# Altium project wing2.PrjPcb
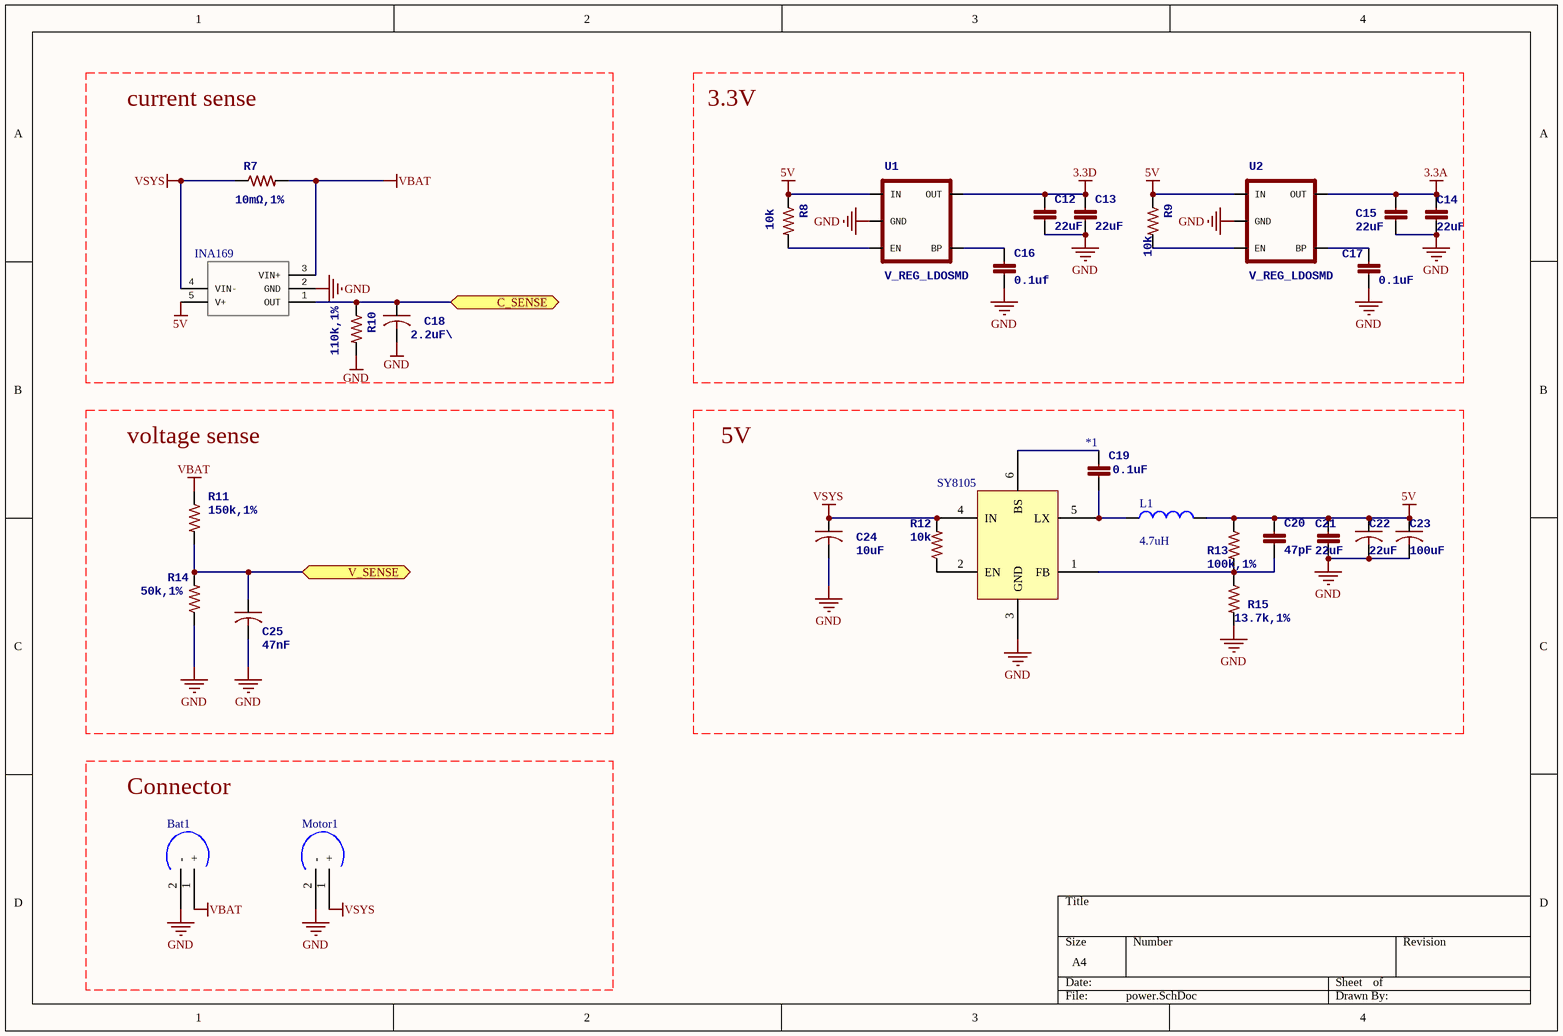
[diagram p0: power.SchDoc]
3 sheets, 79 parts. Net scope: flat (ports and power ports of the same name join across sheets).
Board file: wing2.PcbDoc
Sheets:
  power.SchDoc
  mcu.SchDoc
  sensor.SchDoc

## Sheet power.SchDoc
size A4

### Parts
*1  SY8105  [SOT23-6]
Bat1  Battery_AWG12  [Battery_AWG12]  (value not drawn)
C12  22uF  [0805]
C13  22uF  [0805]
C14  22uF  [0805]
C15  22uF  [0805]
C16  0.1uf  [0402]
C17  0.1uF  [0402]
C18  2.2uF\  [0402]
C19  0.1uF  [0603]
C20  47pF  [0402]
C21  22uF  [0805]
C22  22uF  [0805]
C23  100uF  [1210]
C24  10uF  [0805]
C25  47nF  [0402]
L1  value 4.7uH  [L6028/L6045]  (hidden comment: Inductor)
Motor1  Battery_AWG12  [Battery_AWG12]  (value not drawn)
R7  10mΩ,1%  [2512]
R8  10k  [0402]
R9  10k  [0402]
R10  110k,1%  [0402]
R11  150k,1%  [0402]
R12  10k  [0402]
R13  100k,1%  [0402]
R14  50k,1%  [0402]
R15  13.7k,1%  [0402]
U1  V_REG_LDOSMD  [SOT23-5]
U2  V_REG_LDOSMD  [SOT23-5]
U$1  INA169  [SOT23-5]

### Ports
C_SENSE, V_SENSE

### Nets
3.3A: C14.1 C15.1 U2.5(OUT)
3.3D: C12.1 C13.1 U1.5(OUT)
5V: C20.1 C21.1 C22.1 C23.1 L1.2 R8.1 R9.1 R13.1 U1.1(IN) U2.1(IN) U$1.5(V+)
GND: *1.3(GND) Bat1.2(-) C12.2 C13.2 C14.2 C15.2 C16.2 C17.2 C18.2 C21.2 C22.2 C23.2 C24.2 C25.2 Motor1.2(-) R10.2 R14.1 R15.2 U1.2(GND) U2.2(GND) U$1.2(GND)
VBAT: Bat1.1(+) R7.P$2 R11.1 U$1.3(VIN+)
VSYS: *1.4(IN) C24.1 Motor1.1(+) R7.P$1 R12.2 U$1.4(VIN-)
Net*1_1: *1.1(FB) C20.2 R13.2 R15.1
Net*1_2: *1.2(EN) R12.1
Net*1_5: *1.5(LX) C19.2 L1.1
Net*1_6: *1.6(BS) C19.1
NetADC1_4: C25.1 R11.2 R14.2 ; port V_SENSE
NetADC1_5: C18.1 R10.1 U$1.1(OUT) ; port C_SENSE
NetC16_1: C16.1 U1.4(BP)
NetC17_1: C17.1 U2.4(BP)
NetR8_2: R8.2 U1.3(EN)
NetR9_2: R9.2 U2.3(EN)

### Notes on the sheet
- current sense
- 3.3V
- voltage sense
- 5V
- Connector

### Library data of the parts
C12-C17 C19-C21 = CAP0402-CAP: <b>Capacitor</b> / Standard 0603 ceramic capacitor, and 0.1" leaded capacitor.; PARTNO: CC0402ZRY5V7BB104
C18 C22-C25 = C-USC0402: <B>CAPACITOR</B>, American symbol
L1 = Inductor: Code_IEC: 1005; Published: 8-Jun-2000; LatestRevisionDate: 29-May-2009; LatestRevisionNote: IPC-7351 Footprint Added.; PackageReference: 0402-A; Publisher: Altium Limited; PackageDescription: Chip Inductor; Code_JEITA: 0402
R7 = CSS2725FTL250: pin to pad: P$1>2 P$2>1; DIGIKEY: http://search.digikey.com/us/en/products/CSS2725FTL250/CSS2725FTL250CT-ND/1923235; MFGPN: CSS2725FTL250
R8-R15 = RESISTOR0402-RES: <b>Resistor</b> / Basic schematic elements and footprints for 0603, 1206, and PTH resistors.
U1 U2 = V_REG_LDOSMD: <b>Voltage Regulator LDO</b> / Standard 150mA LDO voltage regulator in SOT-23 layout. Micrel part MIC5205. BP (by-pass) pin is used to lower output noise with 470pF cap.; PARTNO: MIC5207-3.3YM5

## Sheet mcu.SchDoc
size A4
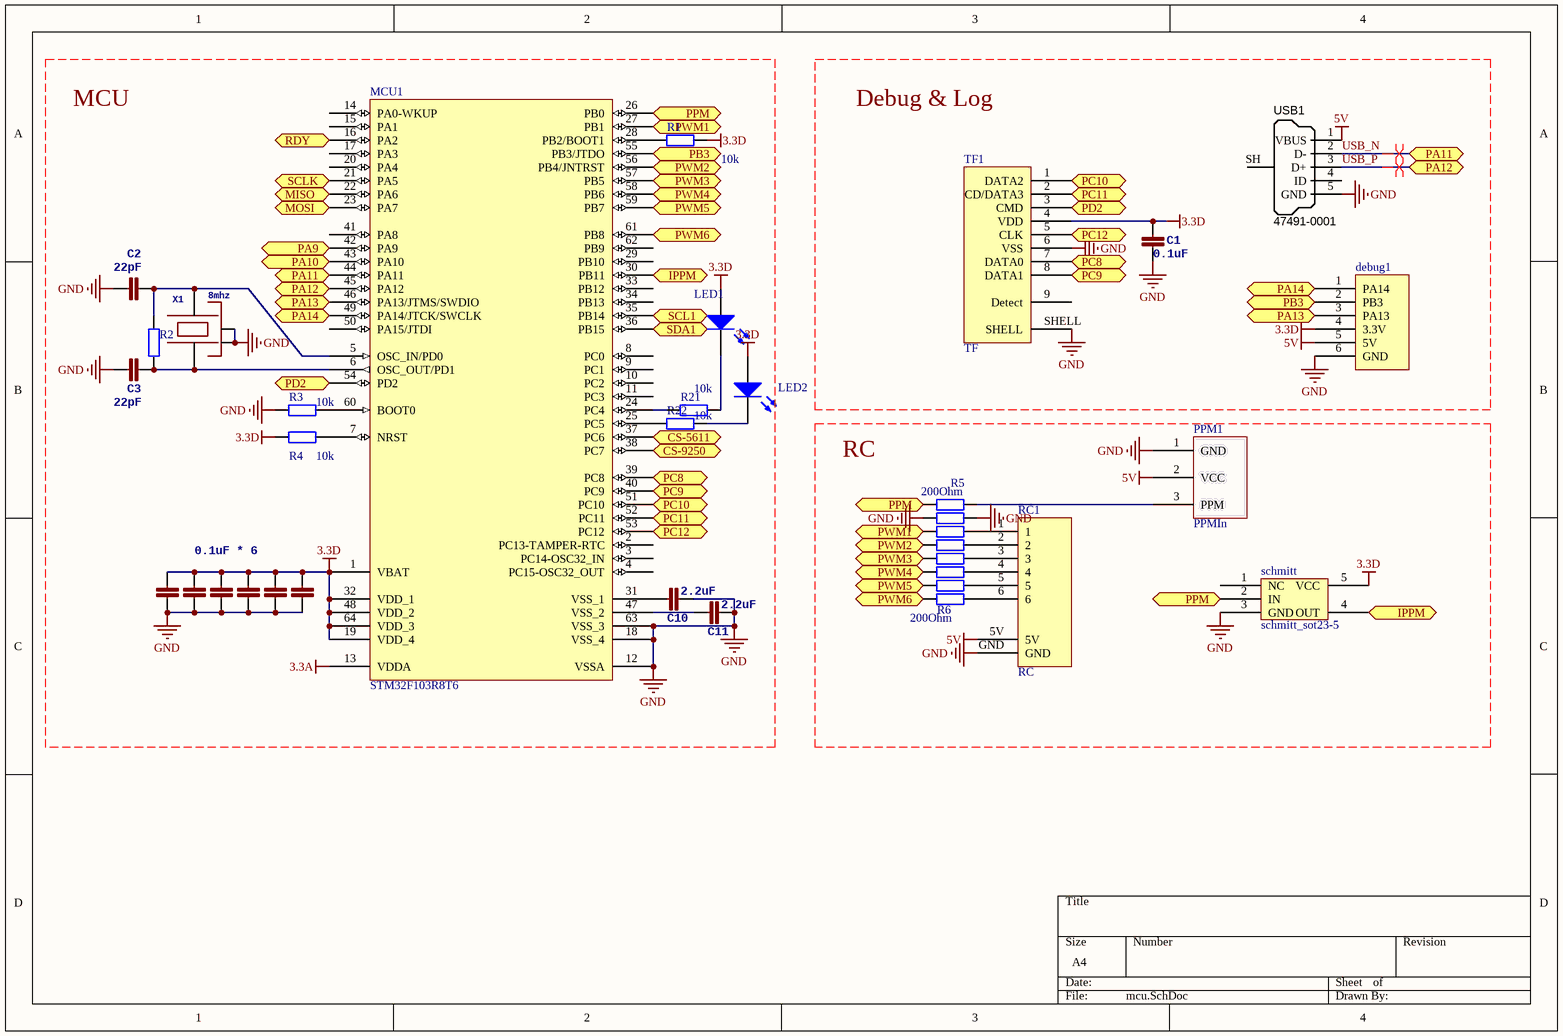
[diagram p1: mcu.SchDoc]

### Parts
C1  0.1uF  [0402]
C2  22pF  [0402]
C3  22pF  [0402]
C4  0.1uF * 6  [0402]
C5  1n  [0402]  (value not drawn)
C6  1n  [0402]  (value not drawn)
C7  1n  [0402]  (value not drawn)
C8  1n  [0402]  (value not drawn)
C9  1n  [0402]  (value not drawn)
C10  2.2uF  [0603]
C11  2.2uF  [0603]
debug1  debug  [WFRSM125]  (value not drawn)
LED1  LED0  [0603]  (value not drawn)
LED2  LED0  [0603]  (value not drawn)
MCU1  STM32F103R8T6  [LQFP64_N]
PPM1  PPMIn  [ServoConnector]
R1  10k  [0402]
R2  (no value)  [0402]
R3  10k  [0402]
R4  10k  [0402]
R5  value 200Ohm  [0402X4]  (hidden comment: Res*4)
R6  value 200Ohm  [0402X4]  (hidden comment: Res*4)
R21  10k  [0402]
R22  10k  [0402]
RC1  RC  [6P]
schmitt  schmitt_sot23-5  [SOT23-5]
TF1  TF  [TF]
USB1  Manufacturer Part Number 1: 47491-0001  [MOLEX-47346-0001]  (hidden comment: USB Micro Type B)
X1  8mhz  [OSCILLATOR-3.2X2.5]

### Ports
CS-5611, CS-9250, IPPM, MISO, MOSI, PA9, PA10, PA11, PA12, PA13, PA14, PB3, PC8, PC9, PC10, PC11, PC12, PD2, PPM, PWM1, PWM2, PWM3, PWM4, PWM5, PWM6, RDY, SCL1, SCLK, SDA1

### Nets
3.3A: MCU1.13(VDDA)
3.3D: C1.2 C4.2 C5.2 C6.2 C7.2 C8.2 C9.2 debug1.4(3.3V) LED1.1(A) LED2.1(A) MCU1.1(VBAT) MCU1.19(VDD_4) MCU1.32(VDD_1) MCU1.48(VDD_2) MCU1.64(VDD_3) R1.2 R4.2 schmitt.5(VCC) TF1.4(VDD)
5V: debug1.5(5V) PPM1.2(VCC) RC1.5V USB1.1(VBUS)
GND: C1.1 C2.2 C3.2 C4.1 C5.1 C6.1 C7.1 C8.1 C9.1 C10.2 C11.2 debug1.6(GND) MCU1.12(VSSA) MCU1.18(VSS_4) MCU1.63(VSS_3) PPM1.1(GND) R3.1 R5.2 R5.7 RC1.GND schmitt.3(GND) TF1.6(VSS) TF1.SHELL USB1.5(GND) X1.2(NC_2) X1.4(NC_4)
USB_N: MCU1.44(PA11) USB1.2(D-) ; port PA11
USB_P: MCU1.45(PA12) USB1.3(D+) ; port PA12
NetADC1_9: MCU1.36(PB15) ; port SDA1
NetADC1_10: MCU1.35(PB14) ; port SCL1
NetBaro1_5: MCU1.37(PC6) ; port CS-5611
NetBaro1_6: MCU1.22(PA6) ; port MISO
NetBaro1_7: MCU1.23(PA7) ; port MOSI
NetBaro1_8: MCU1.21(PA5) ; port SCLK
NetC2_1: C2.1 MCU1.5(OSC_IN/PD0) R2.2 X1.3
NetC3_1: C3.1 MCU1.6(OSC_OUT/PD1) R2.1 X1.1
NetC10_1: C10.1 MCU1.31(VSS_1)
NetC11_1: C11.1 MCU1.47(VSS_2)
Netdebug1_1: debug1.1(PA14) MCU1.49(PA14/JTCK/SWCLK) ; port PA14
Netdebug1_2: debug1.2(PB3) MCU1.55(PB3/JTDO) ; port PB3
Netdebug1_3: debug1.3(PA13) MCU1.46(PA13/JTMS/SWDIO) ; port PA13
NetGPS1_3: MCU1.43(PA10) ; port PA10
NetGPS1_4: MCU1.42(PA9) ; port PA9
NetLED1_2: LED1.2(K) R21.2
NetLED2_2: LED2.2(K) R22.2
NetMCU1_7: MCU1.7(NRST) R4.1
NetMCU1_16: MCU1.16(PA2) ; port RDY
NetMCU1_24: MCU1.24(PC4) R21.1
NetMCU1_25: MCU1.25(PC5) R22.1
NetMCU1_26: MCU1.26(PB0) R5.1 schmitt.2(IN) ; port PPM
NetMCU1_27: MCU1.27(PB1) R5.3 ; port PWM1
NetMCU1_28: MCU1.28(PB2/BOOT1) R1.1
NetMCU1_30: MCU1.30(PB11) schmitt.4(OUT) ; port IPPM
NetMCU1_38: MCU1.38(PC7) ; port CS-9250
NetMCU1_39: MCU1.39(PC8) TF1.7(DATA0) ; port PC8
NetMCU1_40: MCU1.40(PC9) TF1.8(DATA1) ; port PC9
NetMCU1_51: MCU1.51(PC10) TF1.1(DATA2) ; port PC10
NetMCU1_52: MCU1.52(PC11) TF1.2(CD/DATA3) ; port PC11
NetMCU1_53: MCU1.53(PC12) TF1.5(CLK) ; port PC12
NetMCU1_54: MCU1.54(PD2) TF1.3(CMD) ; port PD2
NetMCU1_56: MCU1.56(PB4/JNTRST) R5.4 ; port PWM2
NetMCU1_57: MCU1.57(PB5) R6.1 ; port PWM3
NetMCU1_58: MCU1.58(PB6) R6.2 ; port PWM4
NetMCU1_59: MCU1.59(PB7) R6.3 ; port PWM5
NetMCU1_60: MCU1.60(BOOT0) R3.2
NetMCU1_61: MCU1.61(PB8) R6.4 ; port PWM6
NetPPM1_3: PPM1.3(PPM) R5.8
NetR5_5: R5.5 RC1.2
NetR5_6: R5.6 RC1.1
NetR6_5: R6.5 RC1.6
NetR6_6: R6.6 RC1.5
NetR6_7: R6.7 RC1.4
NetR6_8: R6.8 RC1.3

Not connected (* = marked no-connect by the designer): MCU1 2(PC13-TAMPER-RTC) 3(PC14-OSC32_IN) 4(PC15-OSC32_OUT) 8(PC0) 9(PC1) 10(PC2) 11(PC3) 14(PA0-WKUP) 15(PA1) 17(PA3) 20(PA4) 29(PB10) 33(PB12) 34(PB13) 41(PA8) 50(PA15/JTDI) 62(PB9); schmitt 1(NC); TF1 9(Detect); USB1 4(ID) SH(Shell)

### Layout directives
differential pair: USB_N, USB_P

### Notes on the sheet
- MCU
- Debug & Log
- RC

### Library data of the parts
C1-C11 = CAP0402-CAP: as C12 on sheet power
LED1 LED2 = LED0: Typical INFRARED GaAs LED; Published: 8-Jun-2000; LatestRevisionDate: 08-Jul-2005; LatestRevisionNote: Mech Layer 1 removed.; PackageReference: LED-0; Publisher: Altium Limited; PackageDescription: LED; 2 Leads
MCU1 = STM32F103R8T6: STM32 ARM-based 32-bit MCU with 64 Kbytes Flash, 64-pin LQFP, Industrial Temperature; Published: *; DatasheetVersion: *; PackageVersion: *; PackageReference: *; Publisher: *; PackageDescription: *; ComponentLink1Description: *; ComponentLink1URL: *; ComponentLink2Description: *; ComponentLink2URL: *
R1-R4 R21 R22 = Res2: Resistor; Value: 0Ohm; Published: 8-Jun-2000; LatestRevisionDate: 17-Jul-2002; LatestRevisionNote: Re-released for DXP Platform.; PackageReference: AXIAL-0.4; Publisher: Altium Limited; PackageDescription: Axial Device, Thru-Hole; 2 Leads; 0.4 in Pin Spacing
R5 R6 = Res*4: Resistor; Published: 8-Jun-2000; LatestRevisionDate: 17-Jul-2002; LatestRevisionNote: Re-released for DXP Platform.; PackageReference: AXIAL-0.4; Publisher: Altium Limited; PackageDescription: Axial Device, Thru-Hole; 2 Leads; 0.4 in Pin Spacing
USB1 = USB_Micro_TypeB: Connector SMD USB Micro Type B middle mount; Manufacturer 1: Molex Inc; SCDType: undef; Package / Case: SMD; Supplier 1: Digi-Key; Supplier Part Number 1: WM17142CT-ND
X1 = OSCILLATOR-3.2X2.5: Crystal Oscillator in 3.2x2.5 SMD

## Sheet sensor.SchDoc
size A4
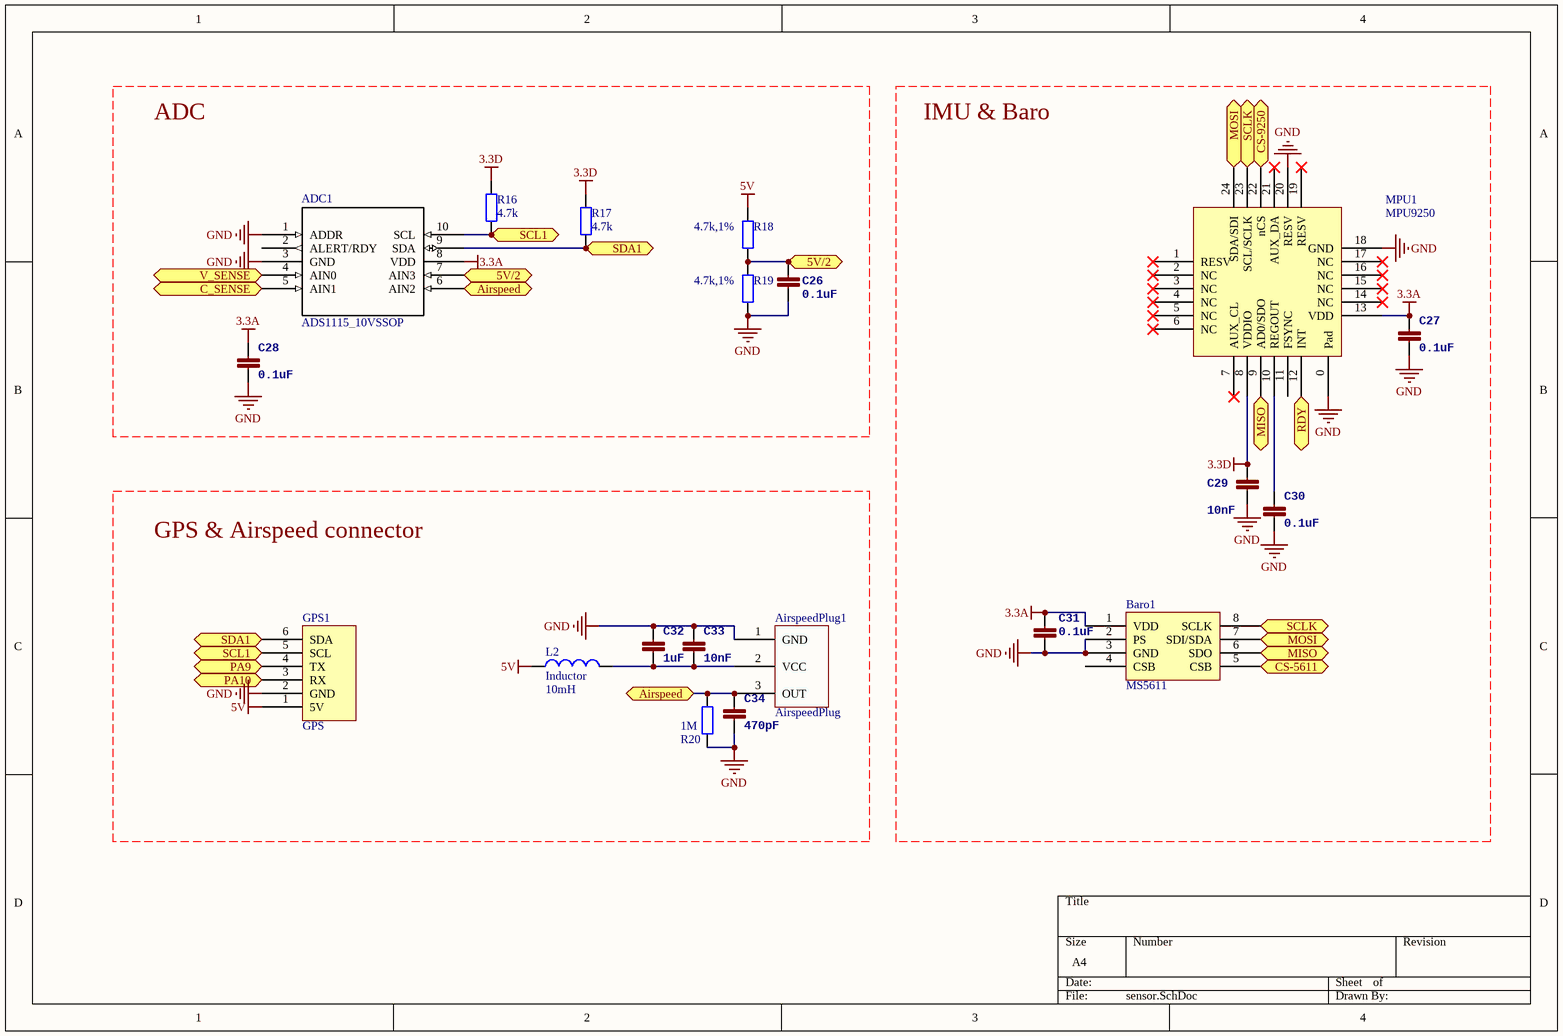
[diagram p2: sensor.SchDoc]

### Parts
ADC1  ADS1115_10VSSOP  [10VSSOP]
AirspeedPlug1  AirspeedPlug  [ServoConnector]
Baro1  MS5611  [MS5611]
C26  0.1uF  [0402]
C27  0.1uF  [0402]
C28  0.1uF  [0402]
C29  10nF  [0402]
C30  0.1uF  [0402]
C31  0.1uF  [0402]
C32  1uF  [0402]
C33  10nF  [0402]
C34  470pF  [0402]
GPS1  GPS  [WFRSM125]
L2  Inductor  value 10mH  [0603]
MPU1  MPU9250  [MPU9250]
R16  4.7k  [0402]
R17  4.7k  [0402]
R18  4.7k,1%  [0402]
R19  4.7k,1%  [0402]
R20  value 1M  [0402]

### Ports
5V/2, Airspeed, C_SENSE, CS-5611, CS-9250, MISO, MOSI, PA9, PA10, RDY, SCL1, SCLK, SDA1, V_SENSE

### Nets
3.3A: ADC1.8(VDD) Baro1.1(VDD) C27.1 C28.1 C31.1 MPU1.13(VDD)
3.3D: C29.1 MPU1.8(VDDIO) R16.1 R17.2
5V: GPS1.1(5V) L2.1 R18.1
GND: ADC1.1(ADDR) ADC1.3(GND) AirspeedPlug1.1(GND) Baro1.2(PS) Baro1.3(GND) C26.1 C27.2 C28.2 C29.2 C30.2 C31.2 C32.1 C33.1 C34.2 GPS1.2(GND) MPU1.0(Pad) MPU1.18(GND) MPU1.20(RESV) R19.2 R20.2
NetADC1_4: ADC1.4(AIN0) ; port V_SENSE
NetADC1_5: ADC1.5(AIN1) ; port C_SENSE
NetADC1_6: ADC1.6(AIN2) AirspeedPlug1.3(OUT) C34.1 R20.1 ; port Airspeed
NetADC1_7: ADC1.7(AIN3) C26.2 R18.2 R19.1 ; port 5V/2
NetADC1_9: ADC1.9(SDA) GPS1.6(SDA) R17.1 ; port SDA1
NetADC1_10: ADC1.10(SCL) GPS1.5(SCL) R16.2 ; port SCL1
NetAirspeedPlug1_2: AirspeedPlug1.2(VCC) C32.2 C33.2 L2.2
NetBaro1_5: Baro1.5(CSB) ; port CS-5611
NetBaro1_6: Baro1.6(SDO) MPU1.9(AD0/SDO) ; port MISO
NetBaro1_7: Baro1.7(SDI/SDA) MPU1.24(SDA/SDI) ; port MOSI
NetBaro1_8: Baro1.8(SCLK) MPU1.23(SCL/SCLK) ; port SCLK
NetC30_1: C30.1 MPU1.10(REGOUT)
NetGPS1_3: GPS1.3(RX) ; port PA10
NetGPS1_4: GPS1.4(TX) ; port PA9
NetMCU1_16: MPU1.12(INT) ; port RDY
NetMCU1_38: MPU1.22(nCS) ; port CS-9250

Not connected (* = marked no-connect by the designer): ADC1 2(ALERT/RDY); Baro1 4(CSB); MPU1 1(RESV)* 2(NC)* 3(NC)* 4(NC)* 5(NC)* 6(NC)* 7(AUX_CL)* 11(FSYNC) 14(NC)* 15(NC)* 16(NC)* 17(NC)* 19(RESV)* 21(AUX_DA)*

### Notes on the sheet
- ADC
- IMU & Baro
- GPS & Airspeed connector

### Library data of the parts
ADC1 = ADS1115_10VSSOP: Manufacturer: Texas Instruments; INDUSTRY_STD_PKG_TYPE: MSOP; FAMILY_NAME: PRECISION ADC (<=10MSPS); PIN_COUNT: 10; PACKAGE_DESIGNATOR: DGS; Datasheet URL: http://www.ti.com/lit/gpn/ADS1115; GENERIC_PART_NUMBER: ADS1115; RefDes: RefDes; Type: DEV; Value: Value
C26-C34 = CAP0402-CAP: as C12 on sheet power
L2 = Inductor: Code_IEC: 1005; Published: 8-Jun-2000; LatestRevisionDate: 29-May-2009; LatestRevisionNote: IPC-7351 Footprint Added.; PackageReference: 0402-A; Publisher: Altium Limited; PackageDescription: Chip Inductor; Code_JEITA: 0402
R16-R19 = Res2: Resistor; Value: 0Ohm; Published: 8-Jun-2000; LatestRevisionDate: 17-Jul-2002; LatestRevisionNote: Re-released for DXP Platform.; PackageReference: AXIAL-0.4; Publisher: Altium Limited; PackageDescription: Axial Device, Thru-Hole; 2 Leads; 0.4 in Pin Spacing
R20 = Res2: Resistor; Published: 8-Jun-2000; LatestRevisionDate: 17-Jul-2002; LatestRevisionNote: Re-released for DXP Platform.; PackageReference: AXIAL-0.4; Publisher: Altium Limited; PackageDescription: Axial Device, Thru-Hole; 2 Leads; 0.4 in Pin Spacing

## Nets that join several sheets
3.3A: power (C14.1 C15.1 U2.5), mcu (MCU1.13), sensor (6 pins)
3.3D: power (C12.1 C13.1 U1.5), mcu (19 pins), sensor (C29.1 MPU1.8 R16.1 R17.2)
5V: power (11 pins), mcu (debug1.5 PPM1.2 RC1.5V USB1.1), sensor (GPS1.1 L2.1 R18.1)
GND: power (21 pins), mcu (26 pins), sensor (20 pins)
NetADC1_4: power (C25.1 R11.2 R14.2), sensor (ADC1.4)
NetADC1_5: power (C18.1 R10.1 U$1.1), sensor (ADC1.5)
NetADC1_9: mcu (MCU1.36), sensor (ADC1.9 GPS1.6 R17.1)
NetADC1_10: mcu (MCU1.35), sensor (ADC1.10 GPS1.5 R16.2)
NetBaro1_5: mcu (MCU1.37), sensor (Baro1.5)
NetBaro1_6: mcu (MCU1.22), sensor (Baro1.6 MPU1.9)
NetBaro1_7: mcu (MCU1.23), sensor (Baro1.7 MPU1.24)
NetBaro1_8: mcu (MCU1.21), sensor (Baro1.8 MPU1.23)
NetGPS1_3: mcu (MCU1.43), sensor (GPS1.3)
NetGPS1_4: mcu (MCU1.42), sensor (GPS1.4)
NetMCU1_16: mcu (MCU1.16), sensor (MPU1.12)
NetMCU1_38: mcu (MCU1.38), sensor (MPU1.22)